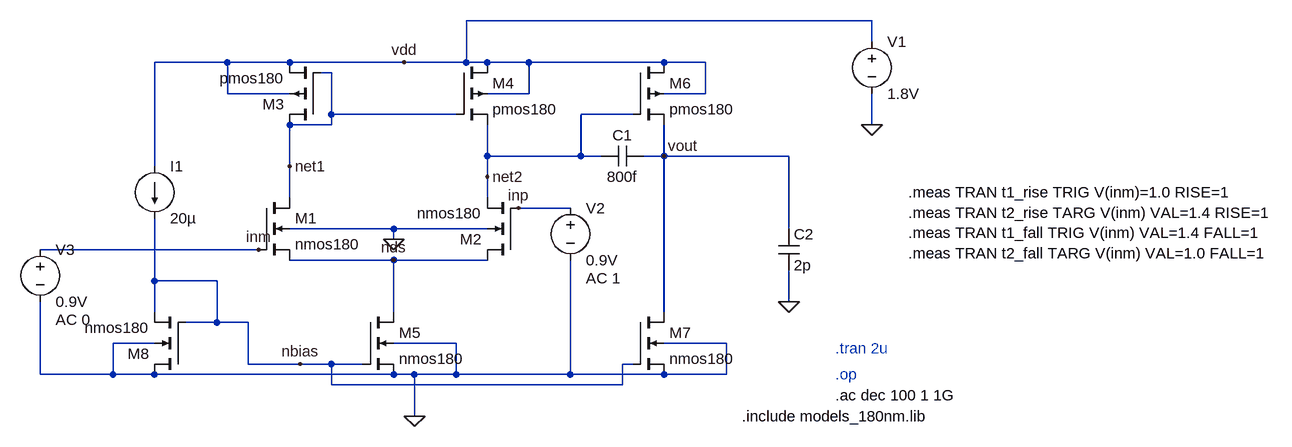
[diagram p0: schematic two_stage_ota.asc]
two_stage_ota.asc, the LTspice schematic file:
Version 4.1
SHEET 1 1568 680
WIRE 912 -176 288 -176
WIRE 912 -144 912 -176
WIRE -80 -112 -192 -112
WIRE 16 -112 -80 -112
WIRE 192 -112 16 -112
WIRE 288 -112 288 -176
WIRE 288 -112 192 -112
WIRE 320 -112 288 -112
WIRE 384 -112 320 -112
WIRE 592 -112 384 -112
WIRE 656 -112 592 -112
WIRE 80 -96 64 -96
WIRE -80 -64 -80 -112
WIRE 16 -64 -80 -64
WIRE 384 -64 384 -112
WIRE 384 -64 320 -64
WIRE 656 -64 656 -112
WIRE 656 -64 592 -64
WIRE 80 -32 80 -96
WIRE 272 -32 80 -32
WIRE 544 -32 464 -32
WIRE 80 -16 80 -32
WIRE 80 -16 16 -16
WIRE 912 -16 912 -64
WIRE 320 32 320 -16
WIRE 464 32 464 -32
WIRE 464 32 320 32
WIRE 496 32 464 32
WIRE 592 32 592 -16
WIRE 592 32 560 32
WIRE 784 32 592 32
WIRE -192 48 -192 -112
WIRE 16 48 16 -16
WIRE 320 64 320 32
WIRE 16 96 16 48
WIRE 320 96 320 64
WIRE 448 112 368 112
WIRE 176 144 16 144
WIRE 320 144 176 144
WIRE 784 144 784 32
WIRE 176 160 176 144
WIRE -32 176 -368 176
WIRE 176 192 16 192
WIRE 320 192 176 192
WIRE -192 224 -192 128
WIRE -96 224 -192 224
WIRE 784 256 784 208
WIRE -192 272 -192 224
WIRE 176 272 176 192
WIRE 592 272 592 32
WIRE -96 288 -96 224
WIRE -96 288 -144 288
WIRE -48 288 -96 288
WIRE -192 320 -256 320
WIRE 272 320 176 320
WIRE 688 320 592 320
WIRE -48 352 -48 288
WIRE 32 352 -48 352
WIRE 80 352 32 352
WIRE 128 352 80 352
WIRE 544 352 528 352
WIRE -368 368 -368 256
WIRE -256 368 -256 320
WIRE -256 368 -368 368
WIRE -192 368 -256 368
WIRE 176 368 -192 368
WIRE 208 368 176 368
WIRE 272 368 272 320
WIRE 272 368 208 368
WIRE 448 368 448 192
WIRE 448 368 272 368
WIRE 592 368 448 368
WIRE 688 368 688 320
WIRE 688 368 592 368
WIRE 80 384 80 352
WIRE 528 384 528 352
WIRE 528 384 80 384
WIRE 208 432 208 368
FLAG 208 432 0
FLAG 784 256 0
FLAG 176 160 0
FLAG 176 192 nds
FLAG 16 48 net1
FLAG 320 64 net2
FLAG 592 32 vout
FLAG 32 352 nbias
FLAG 192 -112 vdd
FLAG -32 176 inm
FLAG 368 112 inp
FLAG 912 -16 0
SYMBOL nmos4 -32 96 R0
SYMATTR InstName M1
SYMATTR Value nmos180
SYMATTR Value2 l=500n w=2.5u
SYMBOL nmos4 368 192 R180
SYMATTR InstName M2
SYMATTR Value nmos180
SYMATTR Value2 l=500nm w=2.5u
SYMBOL nmos4 128 272 R0
SYMATTR InstName M5
SYMATTR Value nmos180
SYMATTR Value2 l=500n w=2.5u
SYMBOL nmos4 544 272 R0
SYMATTR InstName M7
SYMATTR Value nmos180
SYMATTR Value2 l=500n w=19.5u
SYMBOL nmos4 -144 368 R180
SYMATTR InstName M8
SYMATTR Value nmos180
SYMATTR Value2 l=500n w=2.5u
SYMBOL pmos4 64 -16 R180
SYMATTR InstName M3
SYMATTR Value pmos180
SYMATTR Value2 l=500n w=4.5u
SYMBOL pmos4 272 -112 R0
SYMATTR InstName M4
SYMATTR Value pmos180
SYMATTR Value2 l=500n w=4.5u
SYMBOL pmos4 544 -112 R0
SYMATTR InstName M6
SYMATTR Value pmos180
SYMATTR Value2 l=500n w=69.5u
SYMBOL cap 560 16 R90
WINDOW 0 0 32 VBottom 2
WINDOW 3 32 32 VTop 2
SYMATTR InstName C1
SYMATTR Value 800f
SYMBOL cap 768 144 R0
SYMATTR InstName C2
SYMATTR Value 2p
SYMBOL current -192 48 R0
WINDOW 123 0 0 Left 0
WINDOW 39 0 0 Left 0
SYMATTR InstName I1
SYMATTR Value 20µ
SYMBOL voltage 912 -160 R0
WINDOW 123 0 0 Left 0
WINDOW 39 0 0 Left 0
SYMATTR InstName V1
SYMATTR Value 1.8V
SYMBOL voltage 448 96 R0
WINDOW 123 24 124 Left 2
WINDOW 39 0 0 Left 0
SYMATTR Value2 AC 1
SYMATTR InstName V2
SYMATTR Value 0.9V
SYMBOL voltage -368 160 R0
WINDOW 123 24 124 Left 2
WINDOW 39 0 0 Left 0
SYMATTR Value2 AC 0
SYMATTR InstName V3
SYMATTR Value 0.9V
TEXT 712 432 Left 2 !.include models_180nm.lib
TEXT 856 368 Left 2 ;.op
TEXT 856 400 Left 2 !.ac dec 100 1 1G
TEXT 856 328 Left 2 ;.tran 2u
TEXT 968 88 Left 2 !.meas TRAN t1_rise TRIG V(inm)=1.0 RISE=1\n.meas TRAN t2_rise TARG V(inm) VAL=1.4 RISE=1\n.meas TRAN t1_fall TRIG V(inm) VAL=1.4 FALL=1\n.meas TRAN t2_fall TARG V(inm) VAL=1.0 FALL=1

The netlist it stands for:
* two_stage_ota.asc
M1 net1 inm nds 0 nmos180 l=500n w=2.5u
M2 nds inp net2 0 nmos180 l=500nm w=2.5u
M5 nds nbias 0 0 nmos180 l=500n w=2.5u
M7 vout nbias 0 0 nmos180 l=500n w=19.5u
M8 0 nbias nbias 0 nmos180 l=500n w=2.5u
M3 net1 net1 vdd vdd pmos180 l=500n w=4.5u
M4 vdd net1 net2 vdd pmos180 l=500n w=4.5u
M6 vdd net2 vout vdd pmos180 l=500n w=69.5u
C1 vout net2 800f
C2 vout 0 2p
I1 vdd nbias 20µ
V1 vdd 0 1.8V
V2 inp 0 0.9V AC 1
V3 inm 0 0.9V AC 0
.model NMOS NMOS
.model PMOS PMOS
.lib standard.mos
.include models_180nm.lib
* .op
.ac dec 100 1 1G
* .tran 2u
.meas TRAN t1_rise TRIG V(inm)=1.0 RISE=1
.meas TRAN t2_rise TARG V(inm) VAL=1.4 RISE=1
.meas TRAN t1_fall TRIG V(inm) VAL=1.4 FALL=1
.meas TRAN t2_fall TARG V(inm) VAL=1.0 FALL=1
.backanno
.end